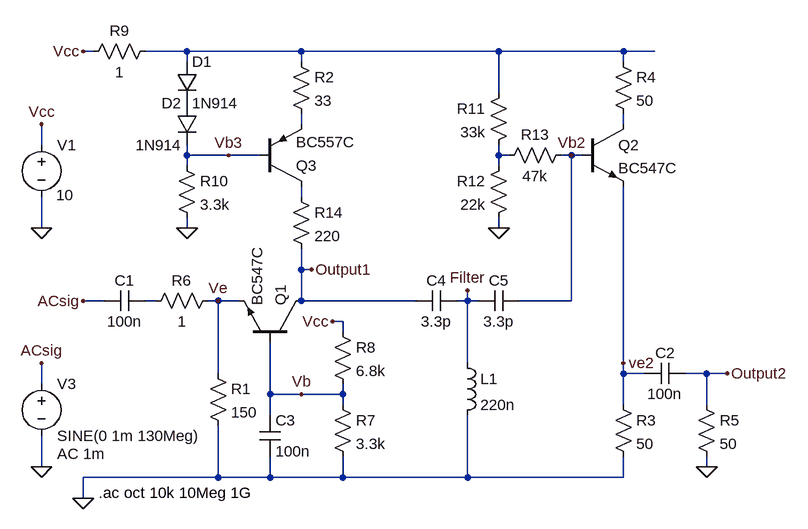
[diagram p0: schematic CommonBaseAmp.asc]
CommonBaseAmp.asc, the LTspice schematic file:
Version 4
SHEET 1 880 880
WIRE -2176 -160 -2192 -160
WIRE -2032 -160 -2096 -160
WIRE -1856 -160 -2032 -160
WIRE -1552 -160 -1856 -160
WIRE -1360 -160 -1552 -160
WIRE -1312 -160 -1360 -160
WIRE -2032 -144 -2032 -160
WIRE -1856 -144 -1856 -160
WIRE -1360 -144 -1360 -160
WIRE -1552 -96 -1552 -160
WIRE -1856 -48 -1856 -64
WIRE -1360 -48 -1360 -64
WIRE -2256 -16 -2256 -48
WIRE -2032 0 -2032 -16
WIRE -1968 0 -2032 0
WIRE -1920 0 -1968 0
WIRE -1552 0 -1552 -16
WIRE -1536 0 -1552 0
WIRE -1440 0 -1456 0
WIRE -1424 0 -1440 0
WIRE -2032 16 -2032 0
WIRE -1552 16 -1552 0
WIRE -1856 64 -1856 48
WIRE -2256 112 -2256 64
WIRE -2032 112 -2032 96
WIRE -1552 112 -1552 96
WIRE -1856 176 -1856 144
WIRE -1840 176 -1856 176
WIRE -2160 224 -2192 224
WIRE -2080 224 -2096 224
WIRE -1984 224 -2000 224
WIRE -1952 224 -1984 224
WIRE -1856 224 -1856 176
WIRE -1680 224 -1856 224
WIRE -1600 224 -1600 208
WIRE -1600 224 -1616 224
WIRE -1584 224 -1600 224
WIRE -1440 224 -1440 0
WIRE -1440 224 -1520 224
WIRE -1792 256 -1808 256
WIRE -1792 272 -1792 256
WIRE -1600 320 -1600 224
WIRE -1360 320 -1360 48
WIRE -1984 336 -1984 224
WIRE -1360 336 -1360 320
WIRE -1328 336 -1360 336
WIRE -1232 336 -1264 336
WIRE -1200 336 -1232 336
WIRE -2256 352 -2256 320
WIRE -1904 368 -1904 288
WIRE -1856 368 -1904 368
WIRE -1792 368 -1792 352
WIRE -1792 368 -1856 368
WIRE -1792 384 -1792 368
WIRE -1360 384 -1360 336
WIRE -1232 384 -1232 336
WIRE -1904 400 -1904 368
WIRE -2256 480 -2256 432
WIRE -1232 480 -1232 464
WIRE -1984 496 -1984 416
WIRE -1984 496 -2192 496
WIRE -1904 496 -1904 464
WIRE -1904 496 -1984 496
WIRE -1792 496 -1792 464
WIRE -1792 496 -1904 496
WIRE -1600 496 -1600 400
WIRE -1600 496 -1792 496
WIRE -1360 496 -1360 464
WIRE -1360 496 -1600 496
WIRE -2192 528 -2192 496
FLAG -2256 112 0
FLAG -2256 -48 Vcc
FLAG -2256 480 0
FLAG -2192 -160 Vcc
FLAG -2256 320 ACsig
FLAG -2192 224 ACsig
FLAG -1840 176 Output1
FLAG -1232 480 0
FLAG -1808 256 Vcc
FLAG -2192 528 0
FLAG -1856 368 Vb
FLAG -1984 224 Ve
FLAG -1200 336 Output2
FLAG -1360 320 ve2
FLAG -2032 112 0
FLAG -1552 112 0
FLAG -1600 208 Filter
FLAG -1440 0 Vb2
FLAG -1968 0 Vb3
SYMBOL voltage -2256 -32 R0
WINDOW 3 23 93 Left 2
WINDOW 123 0 0 Left 2
WINDOW 39 -29 126 VLeft 2
SYMATTR Value 10
SYMATTR InstName V1
SYMBOL voltage -2256 336 R0
WINDOW 123 24 124 Left 2
WINDOW 39 0 0 Left 2
SYMATTR Value2 AC 1m
SYMATTR InstName V3
SYMATTR Value SINE(0 1m 130Meg)
SYMBOL npn -1856 288 M270
SYMATTR InstName Q1
SYMATTR Value BC547C
SYMBOL res -1872 -160 R0
SYMATTR InstName R2
SYMATTR Value 33
SYMBOL res -2000 320 R0
SYMATTR InstName R1
SYMATTR Value 150
SYMBOL cap -2096 208 R90
WINDOW 0 0 32 VBottom 2
WINDOW 3 32 32 VTop 2
SYMATTR InstName C1
SYMATTR Value 100n
SYMBOL npn -1424 -48 R0
SYMATTR InstName Q2
SYMATTR Value BC547C
SYMBOL res -1376 368 R0
SYMATTR InstName R3
SYMATTR Value 50
SYMBOL res -1376 -160 R0
SYMATTR InstName R4
SYMATTR Value 50
SYMBOL cap -1264 320 R90
WINDOW 0 0 32 VBottom 2
WINDOW 3 32 32 VTop 2
SYMATTR InstName C2
SYMATTR Value 100n
SYMBOL res -1248 368 R0
SYMATTR InstName R5
SYMATTR Value 50
SYMBOL res -1984 208 R90
WINDOW 0 0 56 VBottom 2
WINDOW 3 32 56 VTop 2
SYMATTR InstName R6
SYMATTR Value 1
SYMBOL res -1808 368 R0
SYMATTR InstName R7
SYMATTR Value 3.3k
SYMBOL res -1808 256 R0
SYMATTR InstName R8
SYMATTR Value 6.8k
SYMBOL cap -1920 400 R0
SYMATTR InstName C3
SYMATTR Value 100n
SYMBOL cap -1520 208 R90
WINDOW 0 0 32 VBottom 2
WINDOW 3 32 32 VTop 2
SYMATTR InstName C5
SYMATTR Value 3.3p
SYMBOL ind -1616 304 R0
SYMATTR InstName L1
SYMATTR Value 220n
SYMATTR SpiceLine Rser=2
SYMBOL res -2192 -144 R270
WINDOW 0 32 56 VTop 2
WINDOW 3 0 56 VBottom 2
SYMATTR InstName R9
SYMATTR Value 1
SYMBOL diode -2048 -144 R0
SYMATTR InstName D1
SYMATTR Value 1N914
SYMBOL diode -2016 -80 M0
SYMATTR InstName D2
SYMATTR Value 1N914
SYMBOL res -2048 0 R0
SYMATTR InstName R10
SYMATTR Value 3.3k
SYMBOL pnp -1920 48 M180
SYMATTR InstName Q3
SYMATTR Value BC557C
SYMBOL cap -1616 208 R90
WINDOW 0 0 32 VBottom 2
WINDOW 3 32 32 VTop 2
SYMATTR InstName C4
SYMATTR Value 3.3p
SYMBOL res -1536 -112 M0
SYMATTR InstName R11
SYMATTR Value 33k
SYMBOL res -1536 0 M0
SYMATTR InstName R12
SYMATTR Value 22k
SYMBOL res -1440 -16 R90
WINDOW 0 0 56 VBottom 2
WINDOW 3 32 56 VTop 2
SYMATTR InstName R13
SYMATTR Value 47k
SYMBOL res -1872 48 R0
SYMATTR InstName R14
SYMATTR Value 220
TEXT -2168 520 Left 2 !.ac oct 10k 10Meg 1G

The netlist it stands for:
* CommonBaseAmp.asc
V1 Vcc 0 10
V3 ACsig 0 SINE(0 1m 130Meg) AC 1m
Q1 Output1 Vb Ve 0 BC547C
R2 N001 N002 33
R1 Ve 0 150
C1 N006 ACsig 100n
Q2 N003 Vb2 ve2 0 BC547C
R3 ve2 0 50
R4 N001 N003 50
C2 Output2 ve2 100n
R5 Output2 0 50
R6 Ve N006 1
R7 Vb 0 3.3k
R8 Vcc Vb 6.8k
C3 Vb 0 100n
C5 Vb2 Filter 3.3p
L1 Filter 0 220n Rser=2
R9 Vcc N001 1
D1 N001 P001 1N914
D2 P001 Vb3 1N914
R10 Vb3 0 3.3k
Q3 N005 Vb3 N002 0 BC557C
C4 Filter Output1 3.3p
R11 N001 N004 33k
R12 N004 0 22k
R13 Vb2 N004 47k
R14 N005 Output1 220
.model D D
.lib standard.dio
.model NPN NPN
.model PNP PNP
.lib standard.bjt
.ac oct 10k 10Meg 1G
.backanno
.end